# Altium schematic sheet Z7_USB.SchDoc
size A3
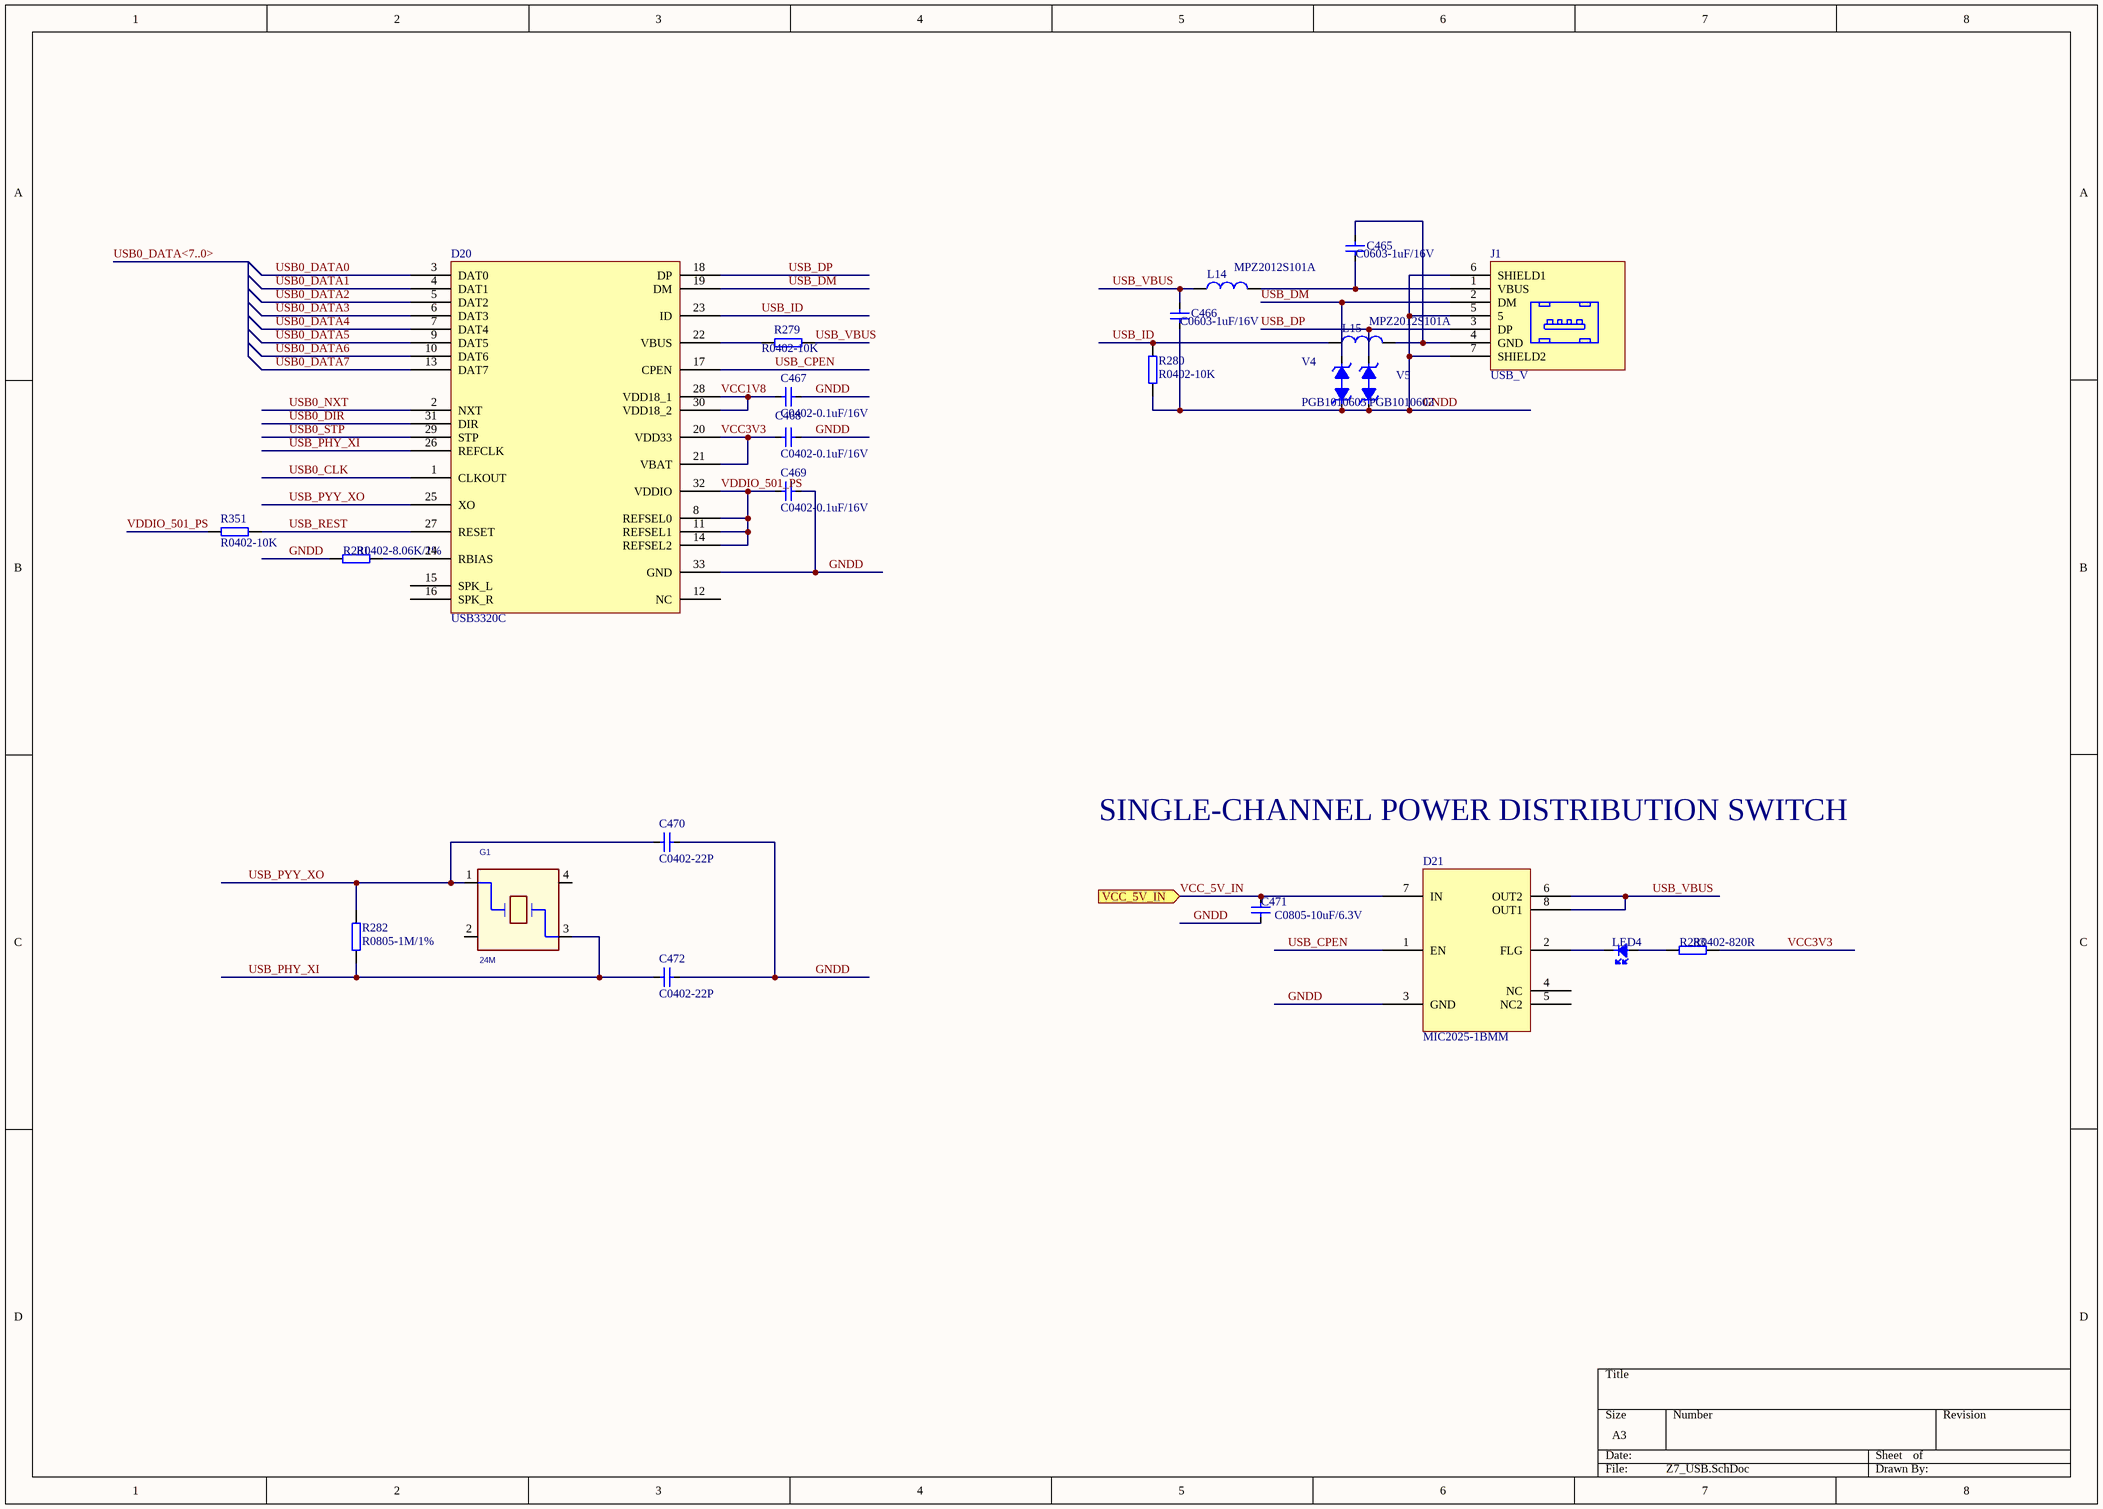
[diagram p0: Z7_USB.SchDoc]

## Parts
C465  C0603-1uF/16V  [C0603]
C466  C0603-1uF/16V  [C0603]
C467  C0402-0.1uF/16V  [C0402]
C468  C0402-0.1uF/16V  [C0402]
C469  C0402-0.1uF/16V  [C0402]
C470  C0402-22P  [C0402]
C471  C0805-10uF/6.3V  [C0805]
C472  C0402-22P  [C0402]
D20  USB3320C  [QFN-32N]
D21  MIC2025-1BMM  [RM-8]
G1  24M  [OSC3225-4P]
J1  USB_V  [USB_TYPEA]
L14  MPZ2012S101A  [R0805]
L15  MPZ2012S101A  [R0805]
LED4  LED0603-GREEN  [LED-R0603]  (value not drawn)
R279  R0402-10K  [R0402]
R280  R0402-10K  [R0402]
R281  R0402-8.06K/1%  [R0402]
R282  R0805-1M/1%  [R0805]
R283  R0402-820R  [R0402]
R351  R0402-10K  [R0402]
V4  PGB1010603  [R0603]
V5  PGB1010603  [R0603]

## Ports
VCC_5V_IN (in)

## Nets
GNDD: C466.2 C467.2 C468.2 C469.2 C470.2 C471.2 C472.2 D20.33(GND) D21.3(GND) J1.5 J1.6(SHIELD1) J1.7(SHIELD2) R280.1 R281.1 V4.1(ANODE) V5.1(ANODE)
USB0_CLK: D20.1(CLKOUT)
USB0_DATA0: D20.3(DAT0)
USB0_DATA1: D20.4(DAT1)
USB0_DATA2: D20.5(DAT2)
USB0_DATA3: D20.6(DAT3)
USB0_DATA4: D20.7(DAT4)
USB0_DATA5: D20.9(DAT5)
USB0_DATA6: D20.10(DAT6)
USB0_DATA7: D20.13(DAT7)
USB0_DIR: D20.31(DIR)
USB0_NXT: D20.2(NXT)
USB0_STP: D20.29(STP)
USB_CPEN: D20.17(CPEN) D21.1(EN)
USB_DM: D20.19(DM) J1.2(DM) V4.2(CATHODE)
USB_DP: D20.18(DP) J1.3(DP) V5.2(CATHODE)
USB_ID: D20.23(ID) L15.1 R280.2
USB_PHY_XI: C472.1 D20.26(REFCLK) G1.3 R282.1
USB_PYY_XO: C470.1 D20.25(XO) G1.1 R282.2
USB_REST: D20.27(RESET) R351.1
USB_VBUS: C466.1 D21.6(OUT2) D21.8(OUT1) L14.1 R279.2
VCC1V8: C467.1 D20.28(VDD18_1) D20.30(VDD18_2)
VCC3V3: C468.1 D20.20(VDD33) D20.21(VBAT) R283.2
VCC_5V_IN: C471.1 D21.7(IN) ; port VCC_5V_IN
VDDIO_501_PS: C469.1 D20.8(REFSEL0) D20.11(REFSEL1) D20.14(REFSEL2) D20.32(VDDIO) R351.2
NetC465_1: C465.1 J1.4(GND) L15.2
NetC465_2: C465.2 J1.1(VBUS) L14.2
NetD20_22: D20.22(VBUS) R279.1
NetD20_24: D20.24(RBIAS) R281.2
NetD21_2: D21.2(FLG) LED4.2(K)
NetLED4_1: LED4.1(A) R283.1

Not connected (* = marked no-connect by the designer): D20 12(NC) 15(SPK_L) 16(SPK_R); D21 4(NC) 5(NC2); G1 2 4

## Buses and harness runs
bus USB0_DATA<7..0>

## Notes on the sheet
- SINGLE-CHANNEL POWER DISTRIBUTION SWITCH

## Library data of the parts
C465 C466 = C0603-100nF/16V: X7R; Part_number: C0603-1uF/16V; Part_type: CAP; Value: C0603-1uF/16V; temperature: -55℃\+125℃; Schematic_Part: CAP; PCB_Footprint: C0603
C467-C470 C472 = C0402-0.1uF/16V: X7R; Manufacturer: SAMSUNG; Manufacturer_p/n: CL05X7R104KO5NNN; Part_type: CAP; temperature: -55℃\+125℃; Schematic_Part: CAP; PCB_Footprint: C0402; datasheet: #DataSheet\C_Samsung_General Capacitors.pdf#
  C467-C469: Part_number: C0402-0.1uF/16V; Value: C0402-0.1uF/16V
  C470 C472: Part_number: C0402-22P; Value: C0402-22P
C471 = C1210-22uF/16V: Part_number: C0805-10uF/6.3V; Part_type: CAP; Value: C0805-10uF/6.3V; Schematic_Part: CAP; PCB_Footprint: C0805
G1 = XTAL_13Y: XTAL 25MHZ -- -- SMT; CLASS: IC; CAD_APPROVED: Yes; MFG_PN01: ABMM-25.000MHZ-B2-T; MFG_NAME01: ABRACON CORP; AGILE_PN: 230-77853; HEIGHT: 1.3MM; ROHS: Yes
J1 = USB_OTG_VBUS: Part_number: USB_V
L14 L15 = FB0805-330R@100MHz: Manufacturer: TDK; Part_number: MPZ2012S101A; Part_type: BEAD; temperature: -55℃\+125℃; Value1: 330R@100MHz; Schematic_Part: BEAD; PCB_Footprint: R0805; Manufacturer_p/n: MPZ2012S101A
LED4 = LED-R_3: 表贴发光二极管, 0603封装, 体积1.6x0.8mm, 绿色, 高度0.8mm; Part_number: LED0603-GREEN
R279-R281 R283 R351 = R0402-10K: Manufacturer: SAMSUNG; Part_type: RES; Schematic_Part: RES; PCB_Footprint: R0402
  R279 R280 R351: Part_number: R0402-10K; Value: R0402-10K
  R281: Part_number: R0402-8.06K/1%; Value: R0402-8.06K/1%
  R283: Part_number: R0402-820R; Value: R0402-820R
R282 = R0805-1M/1%: Manufacturer: SAMSUNG; Part_number: R0805-1M/1%; Part_type: RES; Value: R0805-1M/1%; Schematic_Part: RES; PCB_Footprint: R0805
V4 V5 = PGB1010603: U_Protector_PGB1 Series Lead-Free 0603 Surface Mount ESD Suppressor_PGB1010603_SMT_SOCM-1608_L1.6×W0.78×H0.35mm; Manufacturer: Littelfuse; Designer: WHG; Manufacturer Part Number: PGB1010603; Design Date: 2016.3.24; Value: PGB1010603
D21 = MIC2025-1BMM: Part_number: MIC2025-1BMM